# Altium project lite.PrjPcb
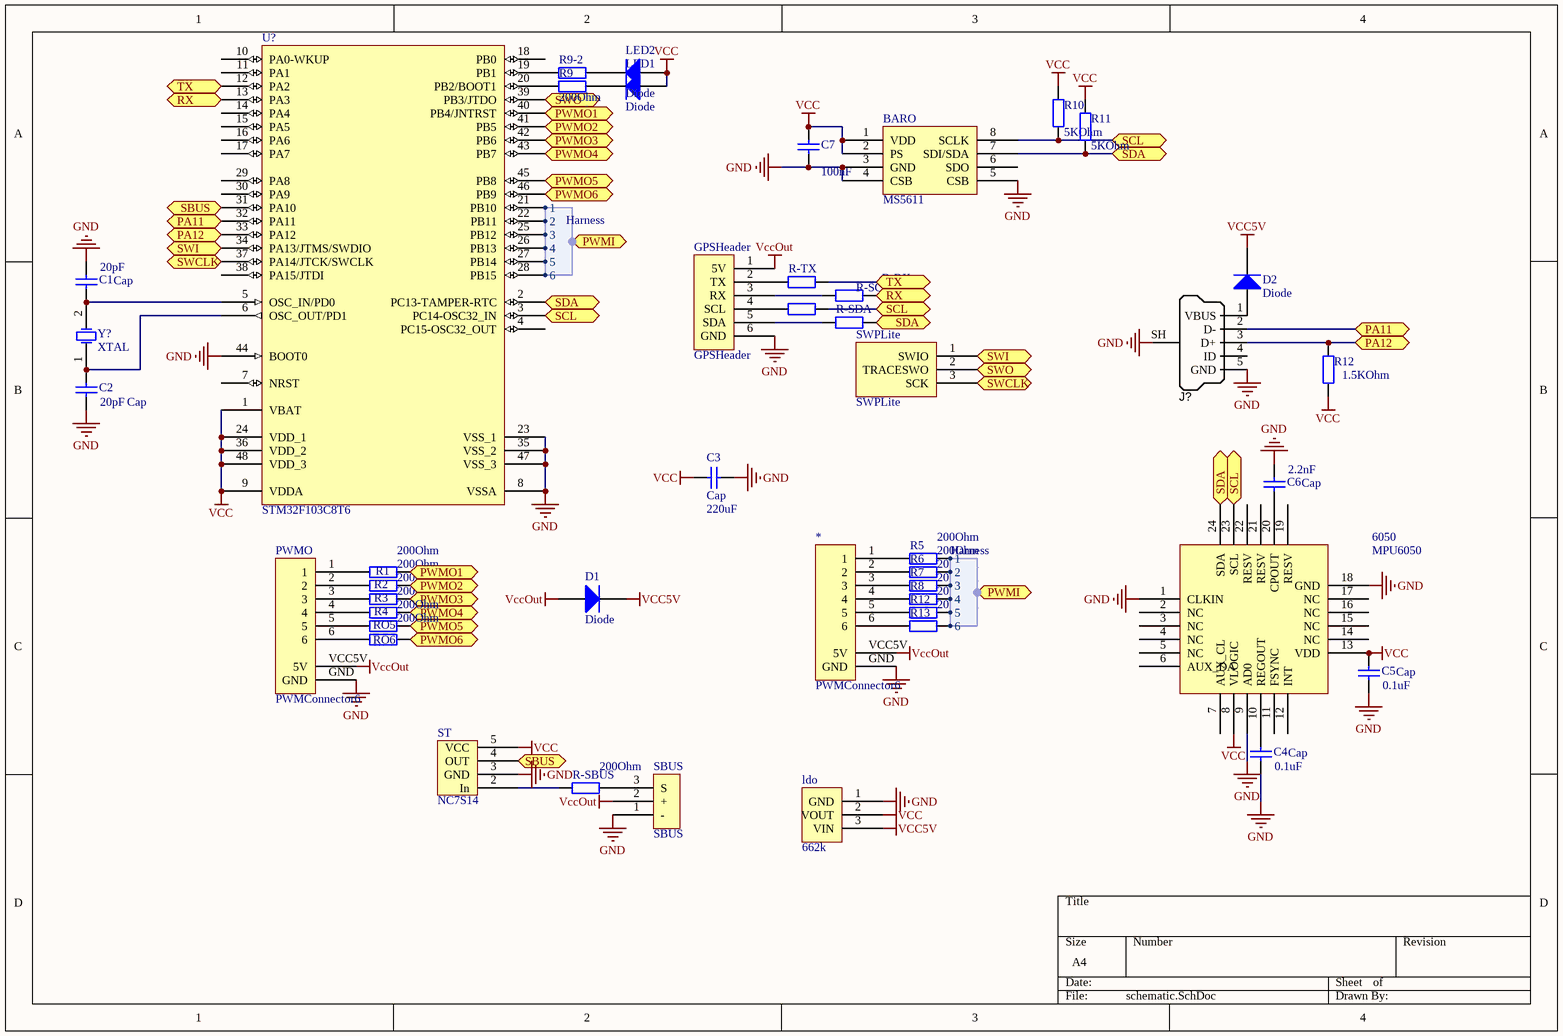
[diagram p0: schematic.SchDoc]
1 sheet, 45 parts. Net scope: flat (ports and power ports of the same name join across sheets).
Board file: lite.PcbDoc

## Sheet schematic.SchDoc
size A4

### Parts
(Parts that share a designator on the sheet are numbered #1, #2 ... from top to bottom, then left to right.)
6050  MPU6050  [MPU6050]
*  PWMConnector6  [PWMConnector6]
BARO  MS5611  [MS5611]
C1  Cap  value 20pF  [0603 - 3D]
C2  Cap  value 20pF  [0603 - 3D]
C3  Cap  value 220uF  [0603 - 3D]
C4  Cap  value 0.1uF  [0603 - 3D]
C5  Cap  value 0.1uF  [0603 - 3D]
C6  Cap  value 2.2nF  [0603 - 3D]
C7  value 100nF  [0603 - 3D]
D1  Diode  [0603 - 3D]
D2  Diode  [0603 - 3D]
GPSHeader  GPSHeader  [DF13C-6P-SMT]
J?  USB Micro Type B (recommended if hand soldering)  [USB]  (value not drawn)
ldo  662k  [SOT23-3]
LED1  Diode  [0603 - 3D]
LED2  Diode  [0603 - 3D]
PWMO  PWMConnector6  [PWMConnector6]
R1  value 200Ohm  [0603 - 3D]
R2  value 200Ohm  [0603 - 3D]
R3  value 200Ohm  [0603 - 3D]
R4  value 200Ohm  [0603 - 3D]
R5  value 200Ohm  [0603 - 3D]
R6  value 200Ohm  [0603 - 3D]
R7  value 200Ohm  [0603 - 3D]
R8  value 200Ohm  [0603 - 3D]
R9  value 200Ohm  [0603 - 3D]
R9-2  value 200Ohm  [0603 - 3D]
R10  value 5KOhm  [0603 - 3D]
R11  value 5KOhm  [0603 - 3D]
R12#1  value 1.5KOhm  [0603 - 3D]
R12#2  value 200Ohm  [0603 - 3D]
R13  value 200Ohm  [0603 - 3D]
R-RX  (no value)  [0603 - 3D]
R-SBUS  value 200Ohm  [0603 - 3D]
R-SCL  (no value)  [0603 - 3D]
R-SDA  (no value)  [0603 - 3D]
R-TX  (no value)  [0603 - 3D]
RO5  value 200Ohm  [0603 - 3D]
RO6  value 200Ohm  [0603 - 3D]
SBUS  SBUS  [SBUS]
ST  NC7S14  [SOT23-5]
SWPLite  SWPLite  [SWPLite]
U?  STM32F103C8T6  [LQFP48_L - 3D]
Y?  XTAL  [5032 - XTAL]

### Ports
PA11, PA12, PWMI (harness Harness), PWMO1, PWMO2, PWMO3, PWMO4, PWMO5, PWMO6, RX, SBUS, SCL, SDA, SWCLK, SWI, SWO, TX

### Harnesses
Harness: 1, 2, 3, 4, 5, 6

### Nets
GND: 6050.1(CLKIN) 6050.9(AD0) 6050.18(GND) *.GND BARO.3(GND) BARO.4(CSB) BARO.5(CSB) C1.2 C2.1 C3.2 C4.1 C5.1 C6.2 C7.1 GPSHeader.6(GND) J?.5(GND) J?.SH(Shell) ldo.1(GND) PWMO.GND SBUS.1(-) ST.3(GND) U?.8(VSSA) U?.23(VSS_1) U?.35(VSS_2) U?.44(BOOT0) U?.47(VSS_3)
VCC: 6050.8(VLOGIC) 6050.13(VDD) BARO.1(VDD) BARO.2(PS) C3.1 C5.2 C7.2 ldo.2(VOUT) LED1.1(A) LED2.1(A) R10.1 R11.1 R12#1.1 ST.5(VCC) U?.1(VBAT) U?.9(VDDA) U?.24(VDD_1) U?.36(VDD_2) U?.48(VDD_3)
VCC5V: D1.2(K) D2.2(K) ldo.3(VIN)
VccOut: *.VCC5V(5V) D1.1(A) GPSHeader.1(5V) PWMO.VCC5V(5V) SBUS.2(+)
Net6050_10: 6050.10(REGOUT) C4.2
Net6050_20: 6050.20(CPOUT) C6.1
Net6050_23: 6050.23(SCL) BARO.8(SCLK) R10.2 R-SCL.1 U?.3(PC14-OSC32_IN) ; port SCL
Net6050_24: 6050.24(SDA) BARO.7(SDI/SDA) R11.2 R-SDA.1 U?.2(PC13-TAMPER-RTC) ; port SDA
Net*_1: *.1 R5.1
Net*_2: *.2 R6.1
Net*_3: *.3 R7.1
Net*_4: *.4 R8.1
Net*_5: *.5 R12#2.1
Net*_6: *.6 R13.1
NetC1_1: C1.1 U?.5(OSC_IN/PD0) Y?.2(OSC2)
NetC2_2: C2.2 U?.6(OSC_OUT/PD1) Y?.1(OSC1)
NetD2_1: D2.1(A) J?.1(VBUS)
NetGPSHeader_2: GPSHeader.2(TX) R-TX.2
NetGPSHeader_3: GPSHeader.3(RX) R-RX.2
NetGPSHeader_4: GPSHeader.4(SCL) R-SCL.2
NetGPSHeader_5: GPSHeader.5(SDA) R-SDA.2
NetJ?_2: J?.2(D-) U?.32(PA11) ; port PA11
NetJ?_3: J?.3(D+) R12#1.2 U?.33(PA12) ; port PA12
NetLED1_2: LED1.2(K) R9.1
NetLED2_2: LED2.2(K) R9-2.1
NetPWMO_1: PWMO.1 R1.1
NetPWMO_2: PWMO.2 R2.1
NetPWMO_3: PWMO.3 R3.1
NetPWMO_4: PWMO.4 R4.1
NetPWMO_5: PWMO.5 RO5.1
NetPWMO_6: PWMO.6 RO6.1
NetR1_2: R1.2 U?.40(PB4/JNTRST) ; port PWMO1
NetR2_2: R2.2 U?.41(PB5) ; port PWMO2
NetR3_2: R3.2 U?.42(PB6) ; port PWMO3
NetR4_2: R4.2 U?.43(PB7) ; port PWMO4
NetR5_2: R5.2 U?.21(PB10) ; port PWMI.1
NetR6_2: R6.2 U?.22(PB11) ; port PWMI.2
NetR7_2: R7.2 U?.25(PB12) ; port PWMI.3
NetR8_2: R8.2 U?.26(PB13) ; port PWMI.4
NetR9-2_2: R9-2.2 U?.19(PB1)
NetR9_2: R9.2 U?.20(PB2/BOOT1)
NetR12#2_2: R12#2.2 U?.27(PB14) ; port PWMI.5
NetR13_2: R13.2 U?.28(PB15) ; port PWMI.6
NetR-RX_1: R-RX.1 U?.13(PA3) ; port RX
NetR-SBUS_1: R-SBUS.1 ST.2(In)
NetR-SBUS_2: R-SBUS.2 SBUS.3(S)
NetR-TX_1: R-TX.1 U?.12(PA2) ; port TX
NetRO5_2: RO5.2 U?.45(PB8) ; port PWMO5
NetRO6_2: RO6.2 U?.46(PB9) ; port PWMO6
NetST_4: ST.4(OUT) U?.31(PA10) ; port SBUS
NetSWPLite_1: SWPLite.1(SWIO) U?.34(PA13/JTMS/SWDIO) ; port SWI
NetSWPLite_2: SWPLite.2(TRACESWO) U?.39(PB3/JTDO) ; port SWO
NetSWPLite_3: SWPLite.3(SCK) U?.37(PA14/JTCK/SWCLK) ; port SWCLK

Not connected (* = marked no-connect by the designer): 6050 2(NC) 3(NC) 4(NC) 5(NC) 6(AUX_DA) 7(AUX_CL) 11(FSYNC) 12(INT) 14(NC) 15(NC) 16(NC) 17(NC) 19(RESV) 21(RESV) 22(RESV); BARO 6(SDO); J? 4(ID); U? 4(PC15-OSC32_OUT) 7(NRST) 10(PA0-WKUP) 11(PA1) 14(PA4) 15(PA5) 16(PA6) 17(PA7) 18(PB0) 29(PA8) 30(PA9) 38(PA15/JTDI)

### Library data of the parts
C1-C7 = Cap: Capacitor; Published: 8-Jun-2000; LatestRevisionDate: 17-Jul-2002; LatestRevisionNote: Re-released for DXP Platform.; PackageReference: RAD-0.3; Publisher: Altium Limited; PackageDescription: Radial Cap, Thru-Hole; 2 Leads; 0.3 in Pin Spacing
D1 D2 LED1 LED2 = Diode: Default Diode; Published: 8-Jun-2000; LatestRevisionDate: 17-Jul-2002; LatestRevisionNote: Re-released for DXP Platform.; PackageVersion: Sep-1996; PackageReference: SMC; Publisher: Altium Limited; PackageDescription: DO-214-AB/SMC; 2 C-Bend Leads; Body 7.9 x 5.9 mm, inc. leads (LxW); Code_JEDEC: DO-214-AB
J? = USB_Micro_TypeB_FCI: Connector SMD-THD USB Micro Type B middle mount; Manufacturer 1: FCI; Manufacturer Part Number 1: 10103593-0001LF; SCDType: undef; Package / Case: SMD/THD mid-mount; Supplier 1: Digi-Key; Supplier Part Number 1: 609-4049-1-ND
R1-R9 R9-2 R10 R11 R12#1 R12#2 R13 R-SBUS RO5 RO6 = Res2: Resistor; Published: 8-Jun-2000; LatestRevisionDate: 17-Jul-2002; LatestRevisionNote: Re-released for DXP Platform.; PackageReference: AXIAL-0.4; Publisher: Altium Limited; PackageDescription: Axial Device, Thru-Hole; 2 Leads; 0.4 in Pin Spacing
R-RX R-SCL R-SDA R-TX = Res2: Resistor; Value: 200Ω; Published: 8-Jun-2000; LatestRevisionDate: 17-Jul-2002; LatestRevisionNote: Re-released for DXP Platform.; PackageReference: AXIAL-0.4; Publisher: Altium Limited; PackageDescription: Axial Device, Thru-Hole; 2 Leads; 0.4 in Pin Spacing
U? = STM32F103C8T6: STM32 ARM-based 32-bit MCU with 64 Kbytes Flash, 48-pin LQFP, Industrial Temperature; Published: *; DatasheetVersion: *; PackageVersion: *; PackageReference: *; Publisher: *; PackageDescription: *; ComponentLink1Description: *; ComponentLink1URL: *; ComponentLink2Description: *; ComponentLink2URL: *
Y? = XTAL: Crystal Oscillator; Published: 8-Jun-2000; LatestRevisionDate: 17-Jul-2002; LatestRevisionNote: Re-released for DXP Platform.; PackageReference: R38; Publisher: Altium Limited; PackageDescription: Crystal, Thru-Hole; 2 Leads; Body 3.1 x 8.2 mm (Dia.xH)